# Altium schematic sheet STM32F469_Controller.SchDoc
size A0
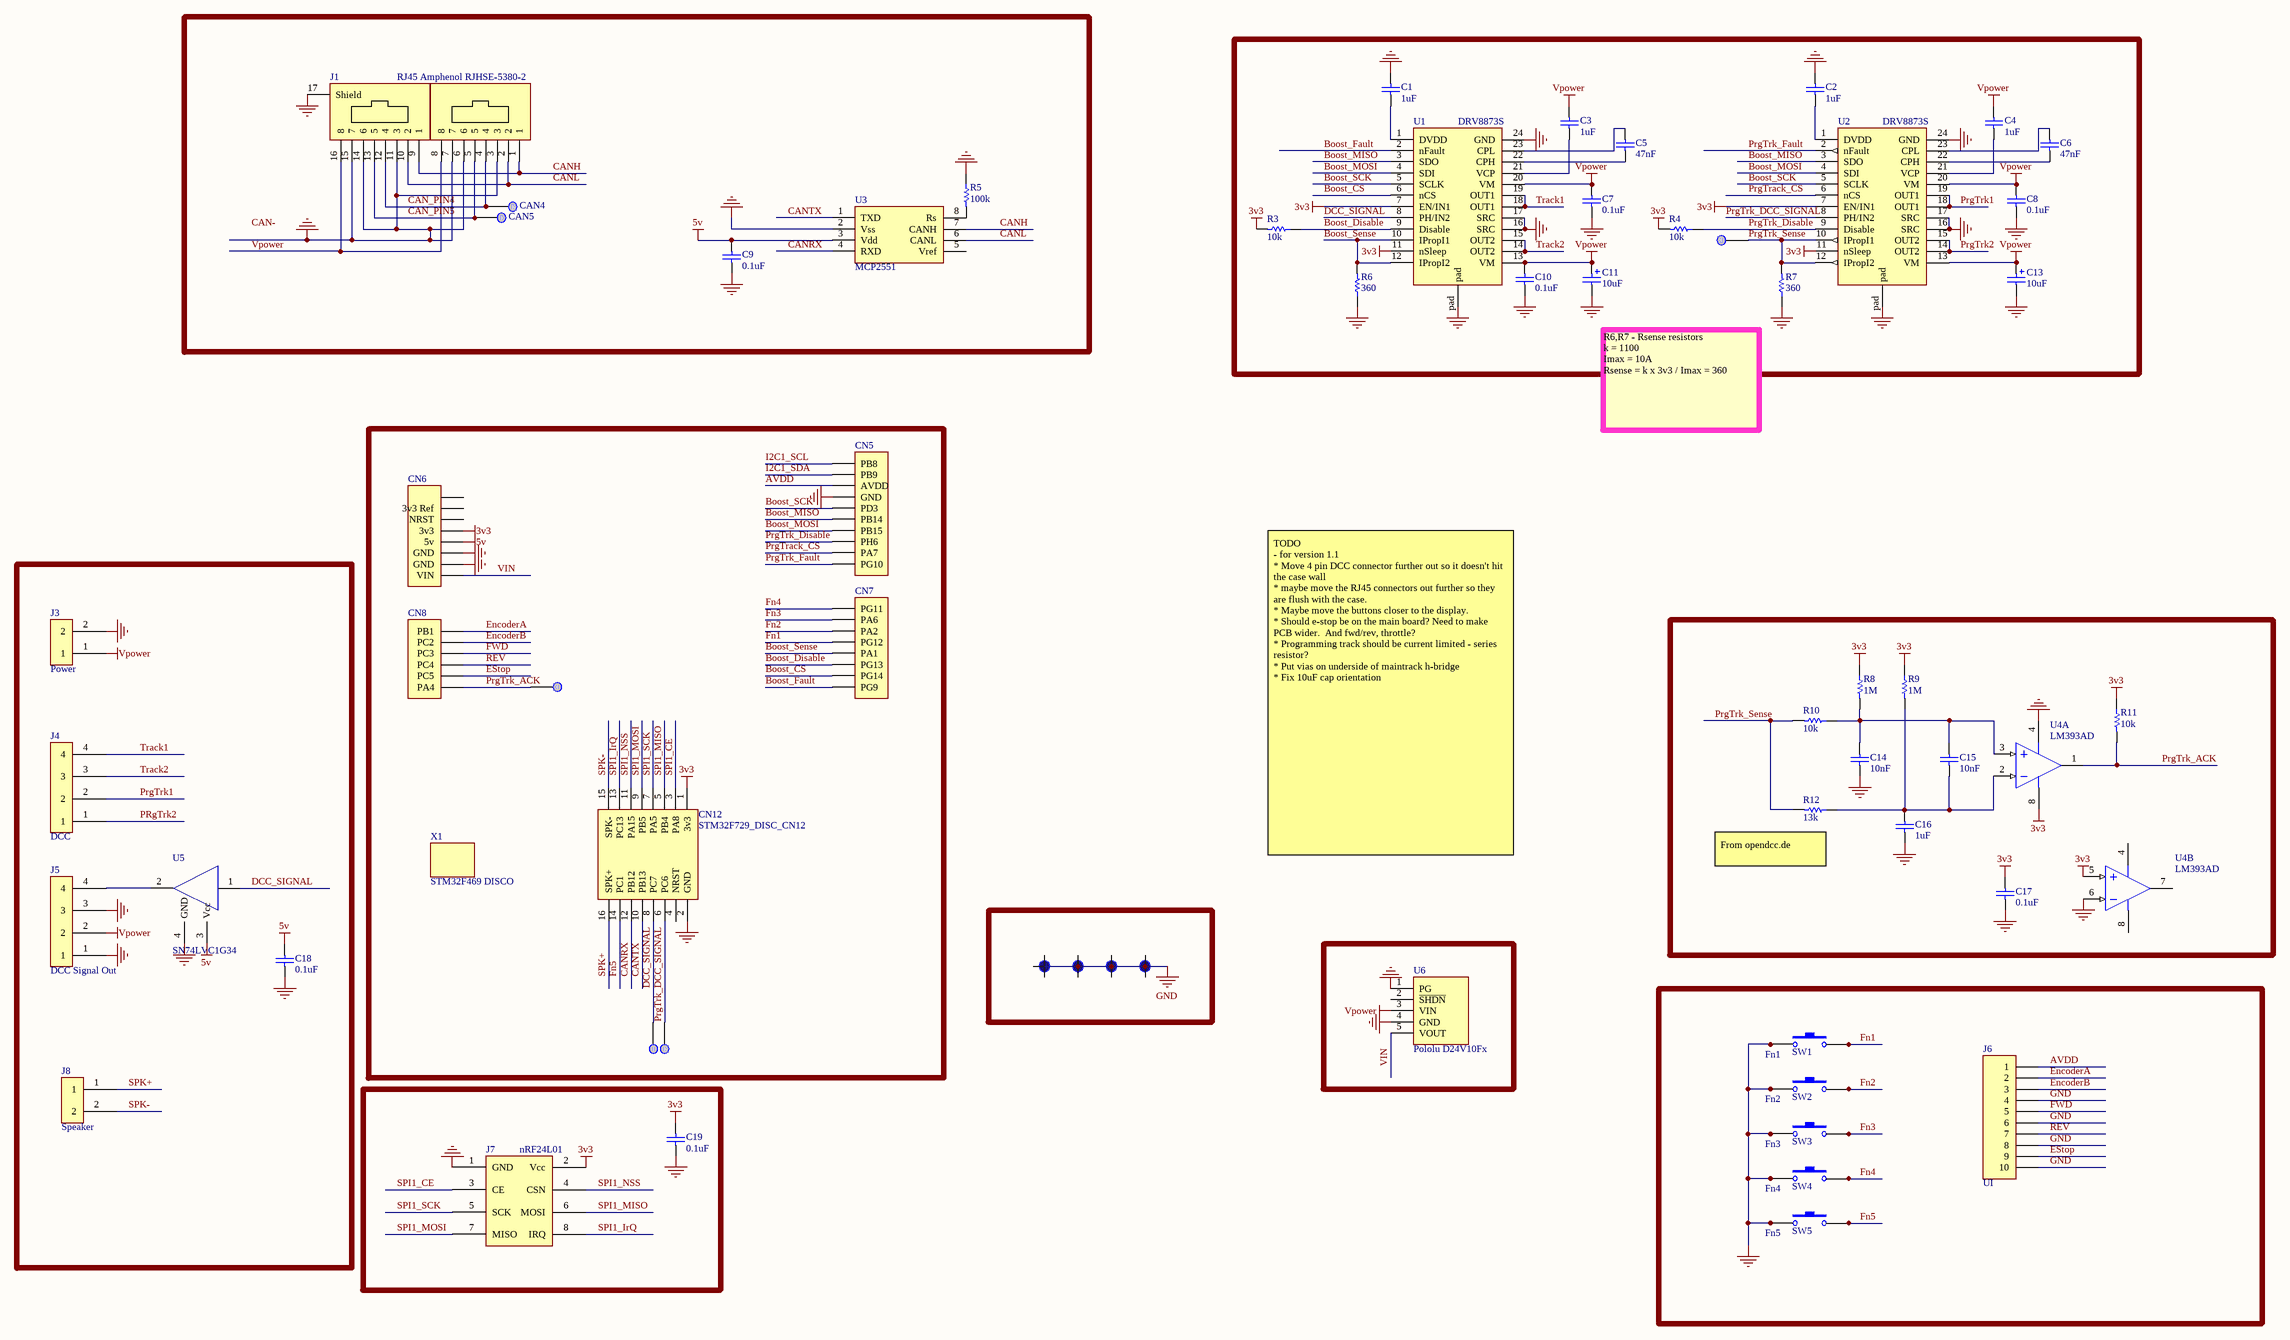
[diagram p0: STM32F469_Controller.SchDoc]

## Parts
C1  value 1uF  [Cap SMD 0805A]  (hidden comment: Cap)
C2  value 1uF  [Cap SMD 0805A]  (hidden comment: Cap)
C3  value 1uF  [Cap SMD 0805A]  (hidden comment: Cap)
C4  value 1uF  [Cap SMD 0805A]  (hidden comment: Cap)
C5  value 47nF  [Cap SMD 0805A]  (hidden comment: Cap)
C6  value 47nF  [Cap SMD 0805A]  (hidden comment: Cap)
C7  value 0.1uF  [Cap SMD 0805A]  (hidden comment: Cap)
C8  value 0.1uF  [Cap SMD 0805A]  (hidden comment: Cap)
C9  value 0.1uF  [Cap SMD 0805A]  (hidden comment: Cap)
C10  value 0.1uF  [Cap SMD 0805A]  (hidden comment: Cap)
C11  value 10uF  [Cap SMD Elect 5x5.3]  (hidden comment: Cap Pol)
C13  value 10uF  [Cap SMD Elect 5x5.3]  (hidden comment: Cap Pol)
C14  value 10nF  [Cap SMD 0805A]  (hidden comment: Cap)
C15  value 10nF  [Cap SMD 0805A]  (hidden comment: Cap)
C16  value 1uF  [Cap SMD 0805A]  (hidden comment: Cap)
C17  value 0.1uF  [Cap SMD 0805A]  (hidden comment: Cap)
C18  value 0.1uF  [Cap SMD 0805A]  (hidden comment: Cap)
C19  value 0.1uF  [Cap SMD 0805A]  (hidden comment: Cap)
CN5  Header 10  [HDR1x10]  (value not drawn)
CN6  Header 8  [HDR1x8]  (value not drawn)
CN7  Header 8  [HDR1x8]  (value not drawn)
CN8  Header 6  [HDR1x6]  (value not drawn)
CN12  STM32F729_DISC_CN12  [HDR2x8 Socket]
H1  Hole  [Mounting Hole M3]  (value not drawn)
H2  Hole  [Mounting Hole M3]  (value not drawn)
H3  Hole  [Mounting Hole M3]  (value not drawn)
H4  Hole  [Mounting Hole M3]  (value not drawn)
J1  RJ45 Amphenol RJHSE-5380-2  [Amphenol RJHSE-5380-2]
J3  Power  [Screw Terminal 2 way 0.2" Horizontal]
J4  DCC  [Screw Terminal 4 way 0.2" Horizontal]
J5  DCC Signal Out  [Screw Terminal 4 way 0.15" Horizontal]
J6  UI  [0.1 SIP 10 PIN R/A]
J7  nRF24L01  [nRF24L01 Mounted]
J8  Speaker  [0.1 SIP 2 PIN R/A]
R3  value 10k  [Res SMD 0805A]  (hidden comment: Res1)
R4  value 10k  [Res SMD 0805A]  (hidden comment: Res1)
R5  value 100k  [Res SMD 0805A]  (hidden comment: Res1)
R6  value 360  [Res SMD 0805A]  (hidden comment: Res1)
R7  value 360  [Res SMD 0805A]  (hidden comment: Res1)
R8  value 1M  [Res SMD 0805A]  (hidden comment: Res1)
R9  value 1M  [Res SMD 0805A]  (hidden comment: Res1)
R10  value 10k  [Res SMD 0805A]  (hidden comment: Res1)
R11  value 10k  [Res SMD 0805A]  (hidden comment: Res1)
R12  value 13k  [Res SMD 0805A]  (hidden comment: Res1)
SW1  Fn1  [SPST Tactile]
SW2  Fn2  [SPST Tactile]
SW3  Fn3  [SPST Tactile]
SW4  Fn4  [SPST Tactile]
SW5  Fn5  [SPST Tactile]
TP1  CAN4  [TestPoint through hole]
TP2  CAN5  [TestPoint through hole]
TP3  PrgTrk Sense  [TestPoint through hole]  (value not drawn)
TP4  PrgTrk ACK  [TestPoint through hole]  (value not drawn)
TP5  PrgTrk ACK  [TestPoint through hole]  (value not drawn)
TP6  PrgTrk ACK  [TestPoint through hole]  (value not drawn)
U1  DRV8873S  [TSSOP24 PowerPAD Long]
U2  DRV8873S  [TSSOP24 PowerPAD Long]
U3  MCP2551  [SOIC8]
U4  LM393AD  [SO8_M]  (parts A,B of 2)
U5  SN74LVC1G34  [SOT-23-5]
U6  Pololu D24V10Fx  [Pololu D24V10Fx]
X1  STM32F469 DISCO  [STM32F749I_Disco]

## Nets
3v3: C17.1 C19.1 CN6.4(3v3) CN12.1(3v3) J7.2(Vcc) R3.2 R4.2 R8.1 R9.1 R11.1 U1.7(EN/IN1) U1.11(nSleep) U2.7(EN/IN1) U2.11(nSleep) U4.5(IN+) U4.8(V+)
5v: C9.1 C18.1 CN6.5(5v) U3.3(Vdd) U5.3(Vcc)  [also labelled VCC]
GND: C1.1 C2.1 C7.1 C8.1 C9.2 C10.1 C11.2 C13.2 C14.1 C16.1 C17.2 C18.2 C19.2 CN5.7(GND) CN6.6(GND) CN6.7(GND) CN12.2(GND) H1.1(GND) H2.1(GND) H3.1(GND) H4.1(GND) J1.3 J1.6 J1.7 J1.11(3) J1.14(6) J1.15(7) J1.17(Shield) J3.2 J5.1 J5.3 J6.4 J6.6 J6.8 J6.10 J7.1(GND) R5.1 R6.1 R7.1 SW1.1a SW1.1b SW2.1a SW2.1b SW3.1a SW3.1b SW4.1a SW4.1b SW5.1a SW5.1b U1.16(SRC) U1.17(SRC) U1.24(GND) U1.pad U2.16(SRC) U2.17(SRC) U2.24(GND) U2.pad U3.2(Vss) U4.4(V-) U4.6(IN-) U5.4(GND) U6.1(PG) U6.4(GND)
Vpower: C3.2 C4.2 C7.2 C8.2 C10.2 C11.1 C13.1 J1.8 J1.16(8) J3.1 J5.2 U1.13(VM) U1.20(VM) U2.13(VM) U2.20(VM) U6.3(VIN)
AVDD: CN5.8(AVDD) J6.1
Boost_CS: CN7.2(PG14) U1.6(nCS)
Boost_Disable: CN7.3(PG13) R3.1 U1.9(Disable)
Boost_Fault: CN7.1(PG9) U1.2(nFault)
Boost_MISO: CN5.5(PB14) U1.3(SDO) U2.3(SDO)
Boost_MOSI: CN5.4(PB15) U1.4(SDI) U2.4(SDI)
Boost_SCK: CN5.6(PD3) U1.5(SCLK) U2.5(SCLK)
Boost_Sense: CN7.4(PA1) R6.2 U1.10(IPropI1) U1.12(IPropI2)
CAN_PIN4: J1.4 J1.12(4) TP1.1
CAN_PIN5: J1.5 J1.13(5) TP2.1
CANH: J1.1 J1.9(1) U3.7(CANH)
CANL: J1.2 J1.10(2) U3.6(CANL)
CANRX: CN12.12(PB12) U3.4(RXD)
CANTX: CN12.10(PB13) U3.1(TXD)
DCC_SIGNAL: CN12.8(PC7) TP5.1 U1.8(PH/IN2) U5.1(A)
EncoderA: CN8.1(PB1) J6.2
EncoderB: CN8.2(PC2) J6.3
EStop: CN8.5(PC5) J6.9
Fn1: CN7.5(PG12) SW1.2a SW1.2b
Fn2: CN7.6(PA2) SW2.2a SW2.2b
Fn3: CN7.7(PA6) SW3.2a SW3.2b
Fn4: CN7.8(PG11) SW4.2a SW4.2b
Fn5: CN12.14(PC1) SW5.2a SW5.2b
FWD: CN8.3(PC3) J6.5
I2C1_SCL: CN5.10(PB8)
I2C1_SDA: CN5.9(PB9)
PrgTrack_CS: CN5.2(PA7) U2.6(nCS)
PrgTrk1: J4.2 U2.18(OUT1) U2.19(OUT1)
PrgTrk2: J4.1 U2.14(OUT2) U2.15(OUT2)
PrgTrk_ACK: CN8.6(PA4) R11.2 TP4.1 U4.1(OUT)
PrgTrk_DCC_SIGNAL: CN12.6(PC6) TP6.1 U2.8(PH/IN2)
PrgTrk_Disable: CN5.3(PH6) R4.1 U2.9(Disable)
PrgTrk_Fault: CN5.1(PG10) U2.2(nFault)
PrgTrk_Sense: R7.2 R10.2 R12.2 TP3.1 U2.10(IPropI1) U2.12(IPropI2)
REV: CN8.4(PC4) J6.7
SPI1_CE: CN12.3(PA8) J7.3(CE)
SPI1_IrQ: CN12.13(PC13) J7.8(IRQ)
SPI1_MISO: CN12.5(PB4) J7.6(MOSI)
SPI1_MOSI: CN12.9(PB5) J7.7(MISO)
SPI1_NSS: CN12.11(PA15) J7.4(CSN)
SPI1_SCK: CN12.7(PA5) J7.5(SCK)
SPK+: CN12.16(SPK+) J8.1
SPK-: CN12.15(SPK-) J8.2
Track1: J4.4 U1.18(OUT1) U1.19(OUT1)
Track2: J4.3 U1.14(OUT2) U1.15(OUT2)
VIN: CN6.8(VIN) U6.5(VOUT)
NetC1_2: C1.2 U1.1(DVDD)
NetC2_2: C2.2 U2.1(DVDD)
NetC3_1: C3.1 U1.21(VCP)
NetC4_1: C4.1 U2.21(VCP)
NetC5_1: C5.1 U1.22(CPH)
NetC5_2: C5.2 U1.23(CPL)
NetC6_1: C6.1 U2.22(CPH)
NetC6_2: C6.2 U2.23(CPL)
NetC14_2: C14.2 C15.2 R8.2 R10.1 U4.3(IN+)
NetC15_1: C15.1 C16.2 R9.2 R12.1 U4.2(IN-)
NetJ5_4: J5.4 U5.2(Y)
NetR5_2: R5.2 U3.8(Rs)

Not connected (* = marked no-connect by the designer): CN6 1 2(3v3_Ref) 3(NRST); CN12 4(NRST); U3 5(Vref); U4 7(OUT); U6 2(~{SHDN})

## Notes on the sheet
- R6,R7 - Rsense resistors
  k = 1100
  Imax = 10A
  Rsense = k x 3v3 / Imax = 360
- TODO
  - for version 1.1
  * Move 4 pin DCC connector further out so it doesn't hit the case wall
  * maybe move the RJ45 connectors out further so they are flush with the case.
  * Maybe move the buttons closer to the display.
  * Should e-stop be on the main board? Need to make PCB wider.  And fwd/rev, throttle?
  * Programming track should be current limited - series resistor?
  * Put vias on underside of maintrack h-bridge
  * Fix 10uF cap orientation
- (near R12) From opendcc.de
- Labels drawn without touching a wire or pin: CAN-

## Library data of the parts
C1-C10 C14-C19 = Cap: Capacitor; Published: 8-Jun-2000; LatestRevisionDate: 17-Jul-2002; LatestRevisionNote: Re-released for DXP Platform.; PackageReference: RAD-0.3; Publisher: Altium Limited; PackageDescription: Radial Cap, Thru-Hole; 2 Leads; 0.3 in Pin Spacing
C11 C13 = Cap Pol: Polarized Capacitor (Radial); Published: 8-Jun-2000; LatestRevisionDate: 17-Jul-2002; LatestRevisionNote: Re-released for DXP Platform.; PackageReference: RB7.6-15; Publisher: Altium Limited; PackageDescription: Polarized Capacitor (Radial); 2 Leads
CN5 J6 = Header 10: Header, 10-Pin; LatestRevisionDate: 17-Jul-2002; LatestRevisionNote: Re-released for DXP Platform.; Publisher: Altium Limited
CN6 CN7 = Header 8: Header, 8-Pin; LatestRevisionDate: 17-Jul-2002; LatestRevisionNote: Re-released for DXP Platform.; Publisher: Altium Limited
CN8 = Header 6: Header, 6-Pin; LatestRevisionDate: 17-Jul-2002; LatestRevisionNote: Re-released for DXP Platform.; Publisher: Altium Limited
H1-H4 = MountingHole
J1 = RJ45-2
J3 J8 = SIP2 CONNECTOR
J4 J5 = SIP4 CONNECTOR
J7 = HDR2x4
R3-R12 = Resistor
SW1-SW5 = SPST Micro Pushbutton
TP1-TP6 = TestPoint
U3 = MCP2551: MCP2551 High Speed CAN Transceiver
U4 = LM393AD: Low-Power Dual Voltage Comparator; Published: 24-Aug-2001; LatestRevisionDate: 13-Apr-2006; LatestRevisionNote: IPC-7351 Footprint Added.; DatasheetVersion: Nov-1992; PackageVersion: Dec-2002; PackageReference: SO8; Publisher: Altium Limited; PackageDescription: 8-Pin Small Outline Integrated Circuit 1.27 mm Pitch; Code_JEDEC: MS-012-AA; Code_IPC: SOIC127P600-8; ComponentLink1Description: Manufacturer Link; ComponentLink1URL: http://www.st.com/; ComponentLink2Description: Datasheet; ComponentLink2URL: http://www.st.com/stonline/products/literature/ds/2164/lm193.pdf
U5 = SN74LVC1G34: pin to pad: 1>2 2>4 3>5 4>3
X1 = PCB